# EAGLE schematic FlightControllerBoard (EAGLE 9.0.0)
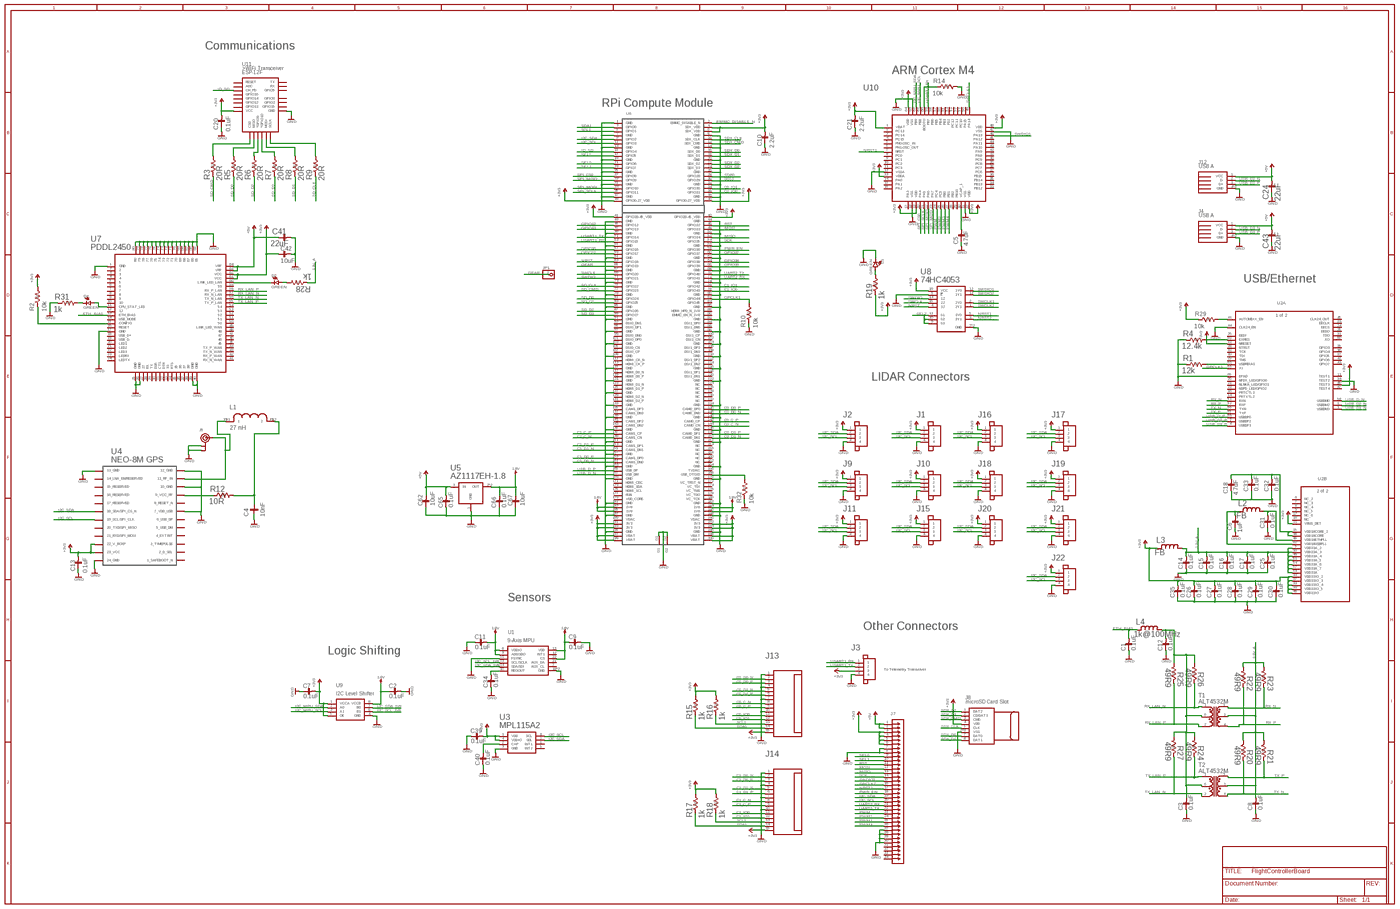
[diagram p0: schematic, sheet 1, overview]
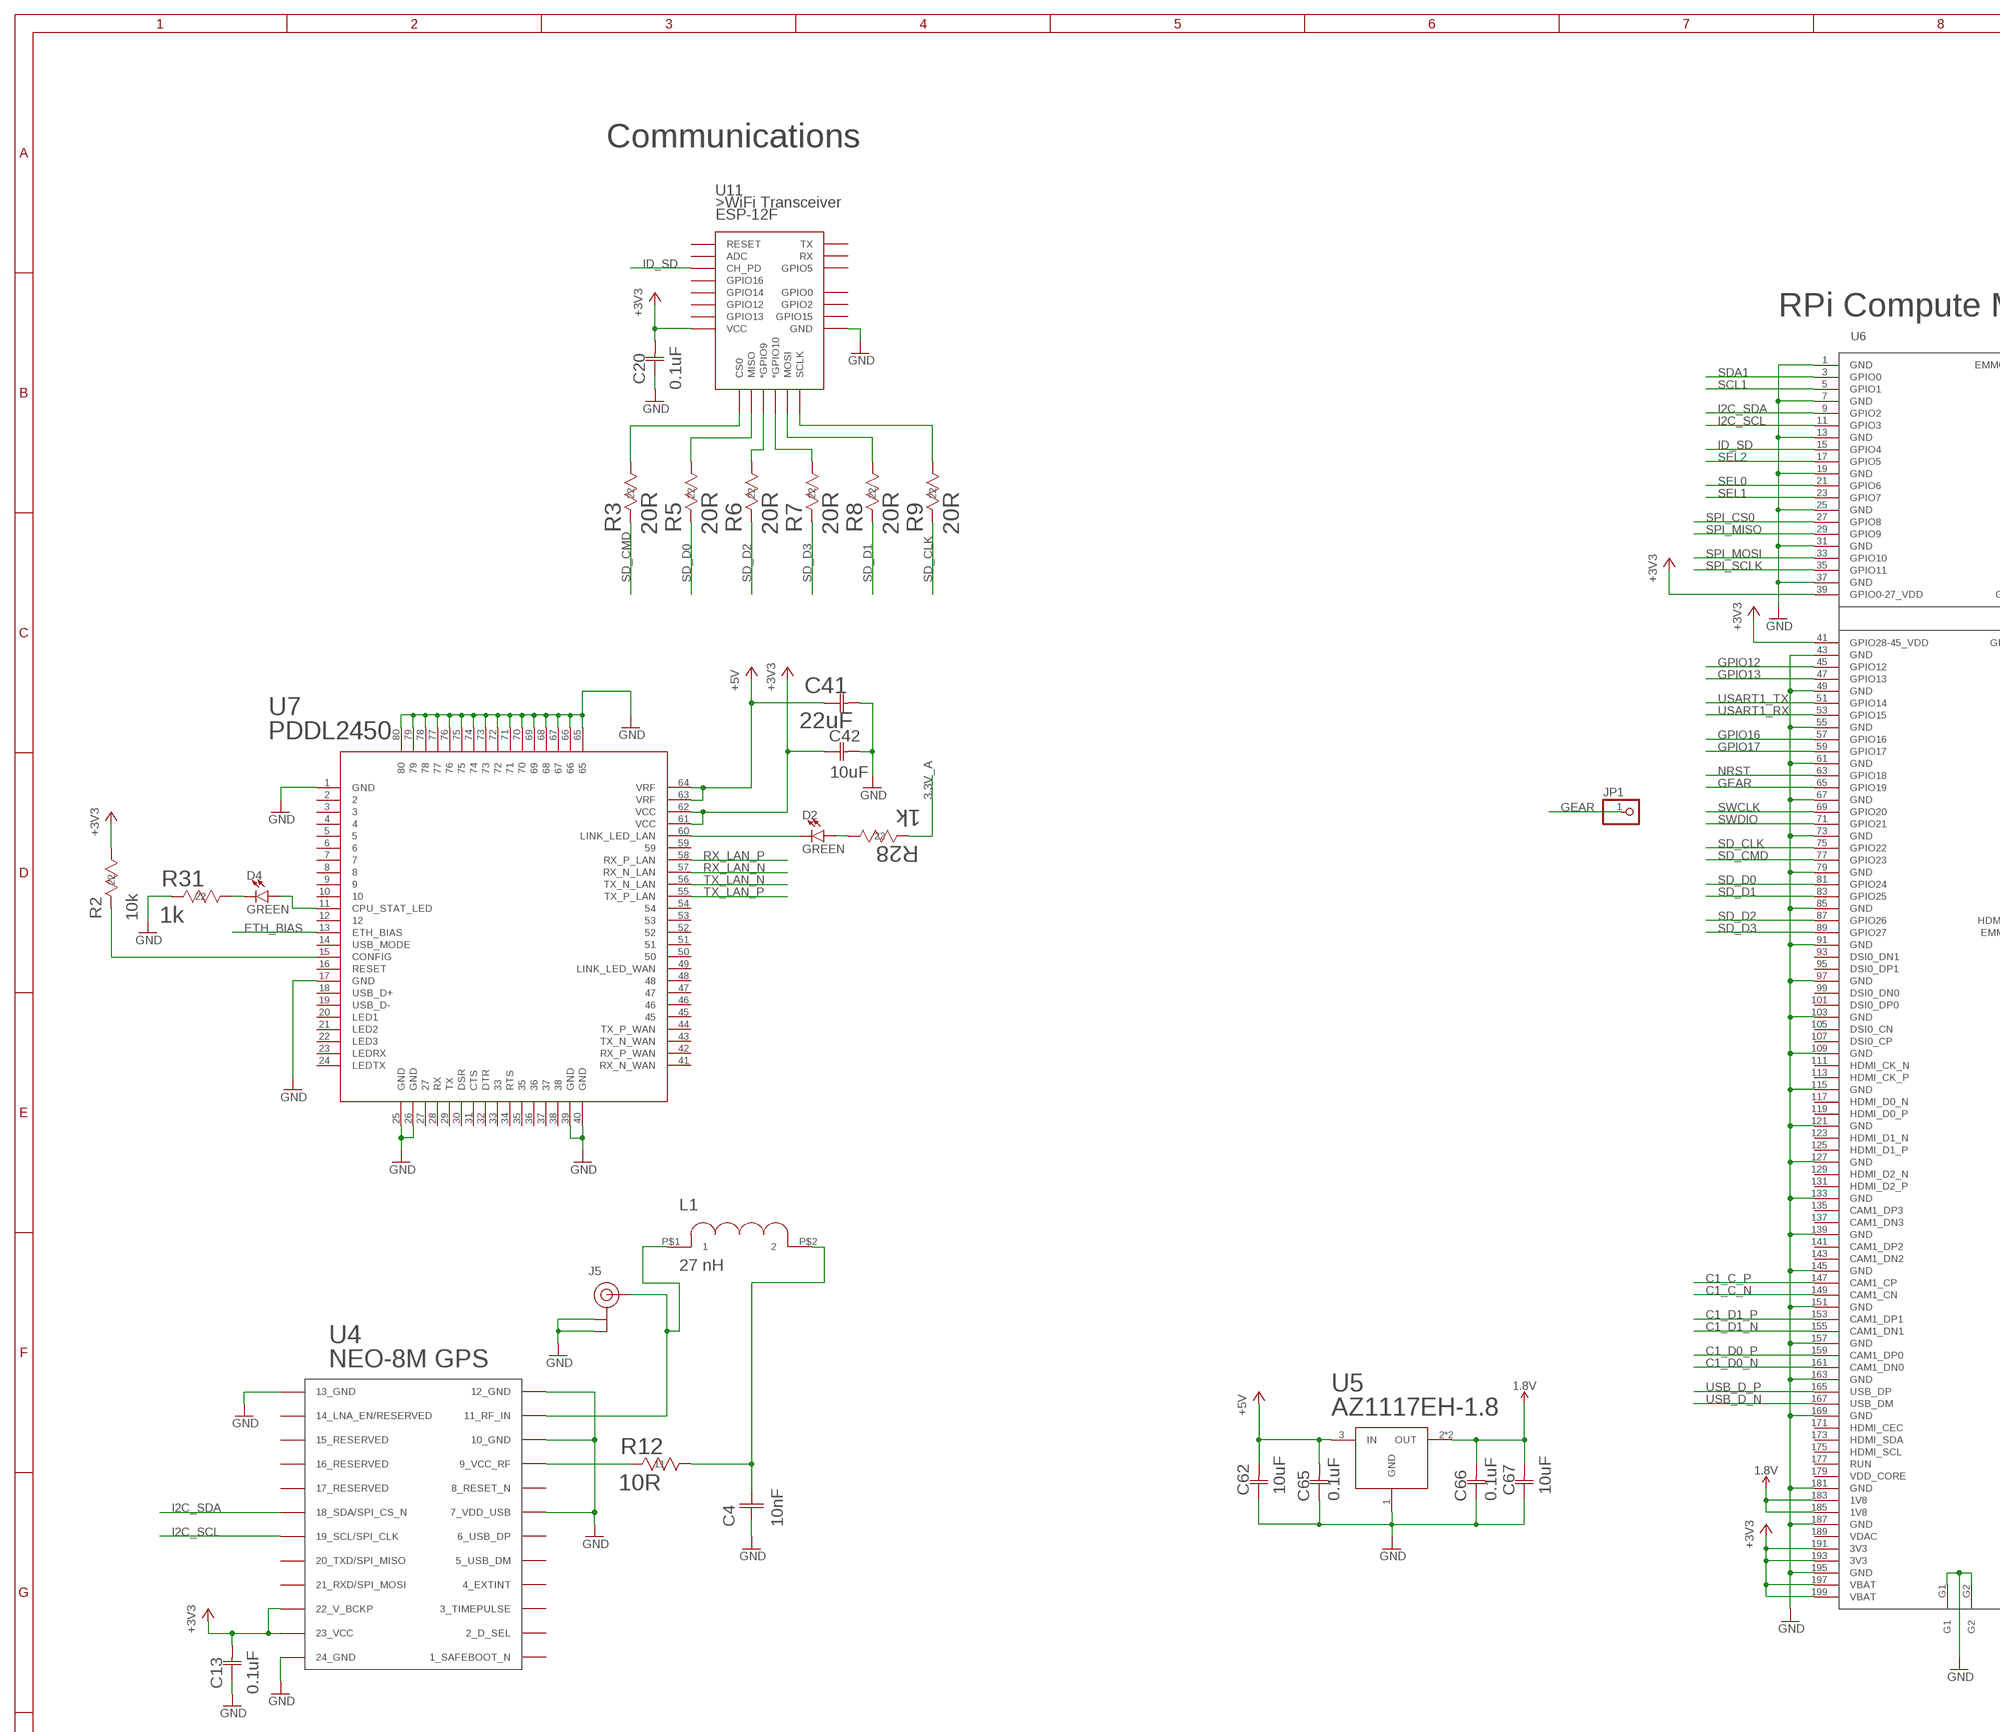
[diagram p1: schematic, sheet 1, part 1 of 4]
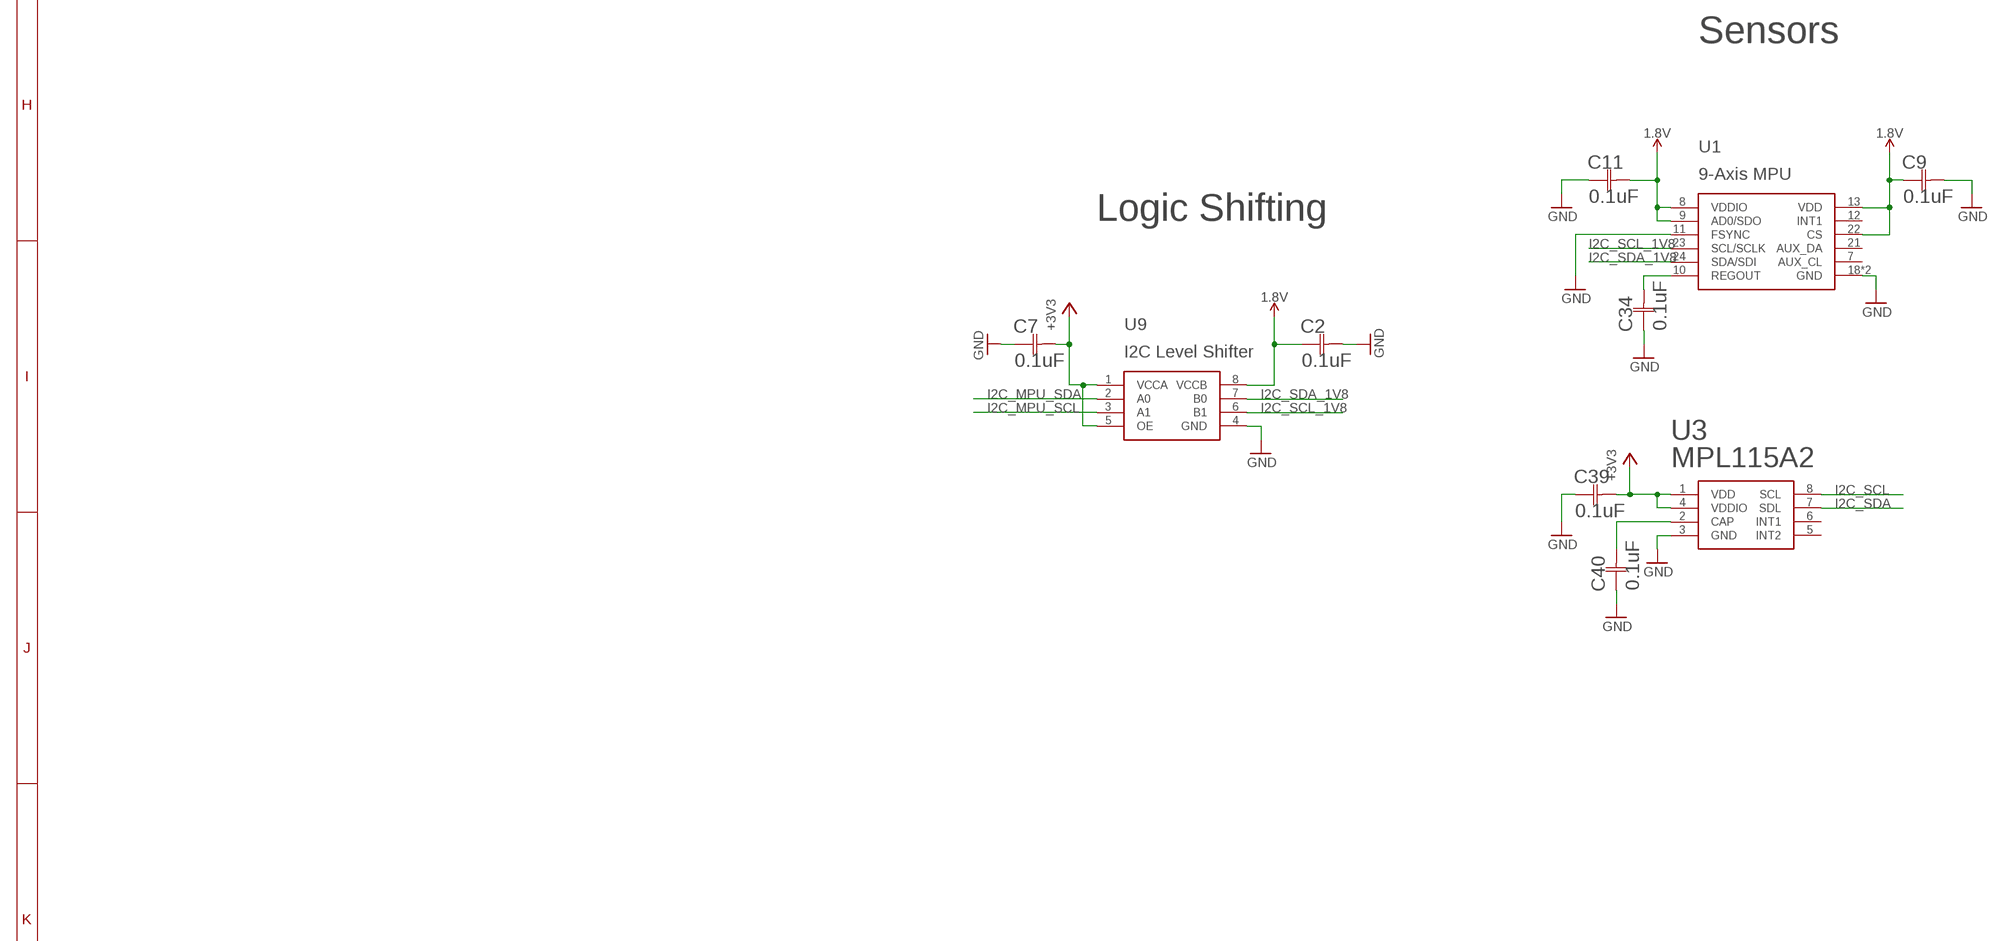
[diagram p2: schematic, sheet 1, part 2 of 4]
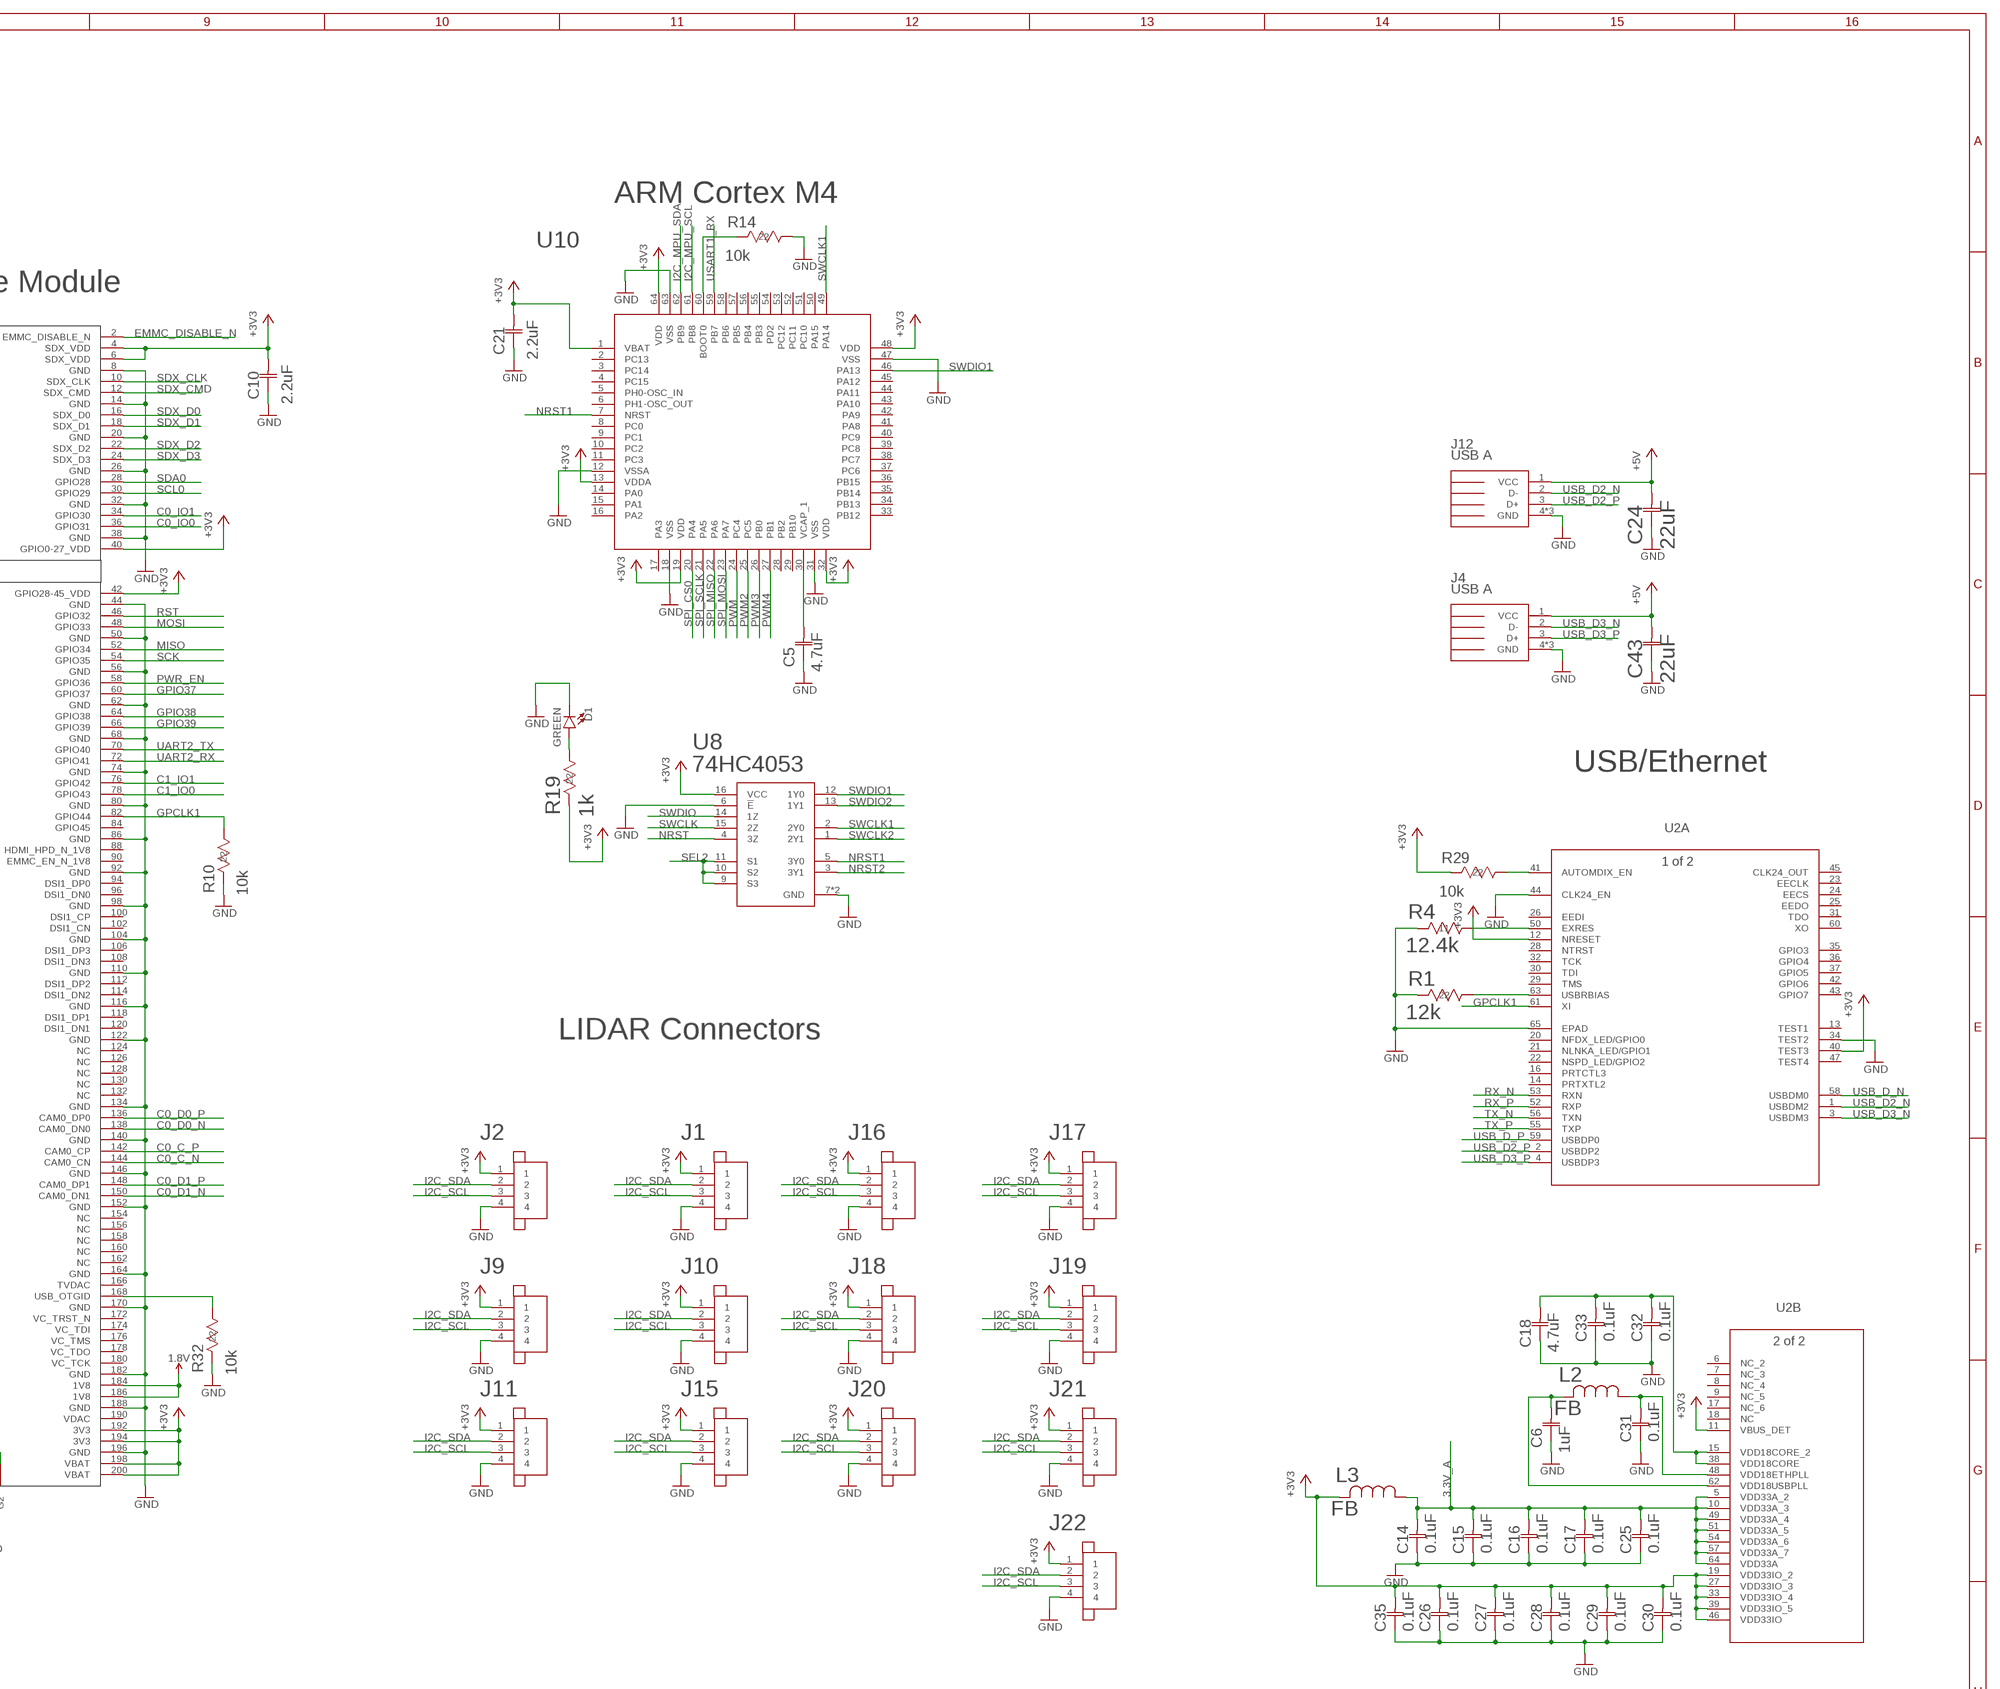
[diagram p3: schematic, sheet 1, part 3 of 4]
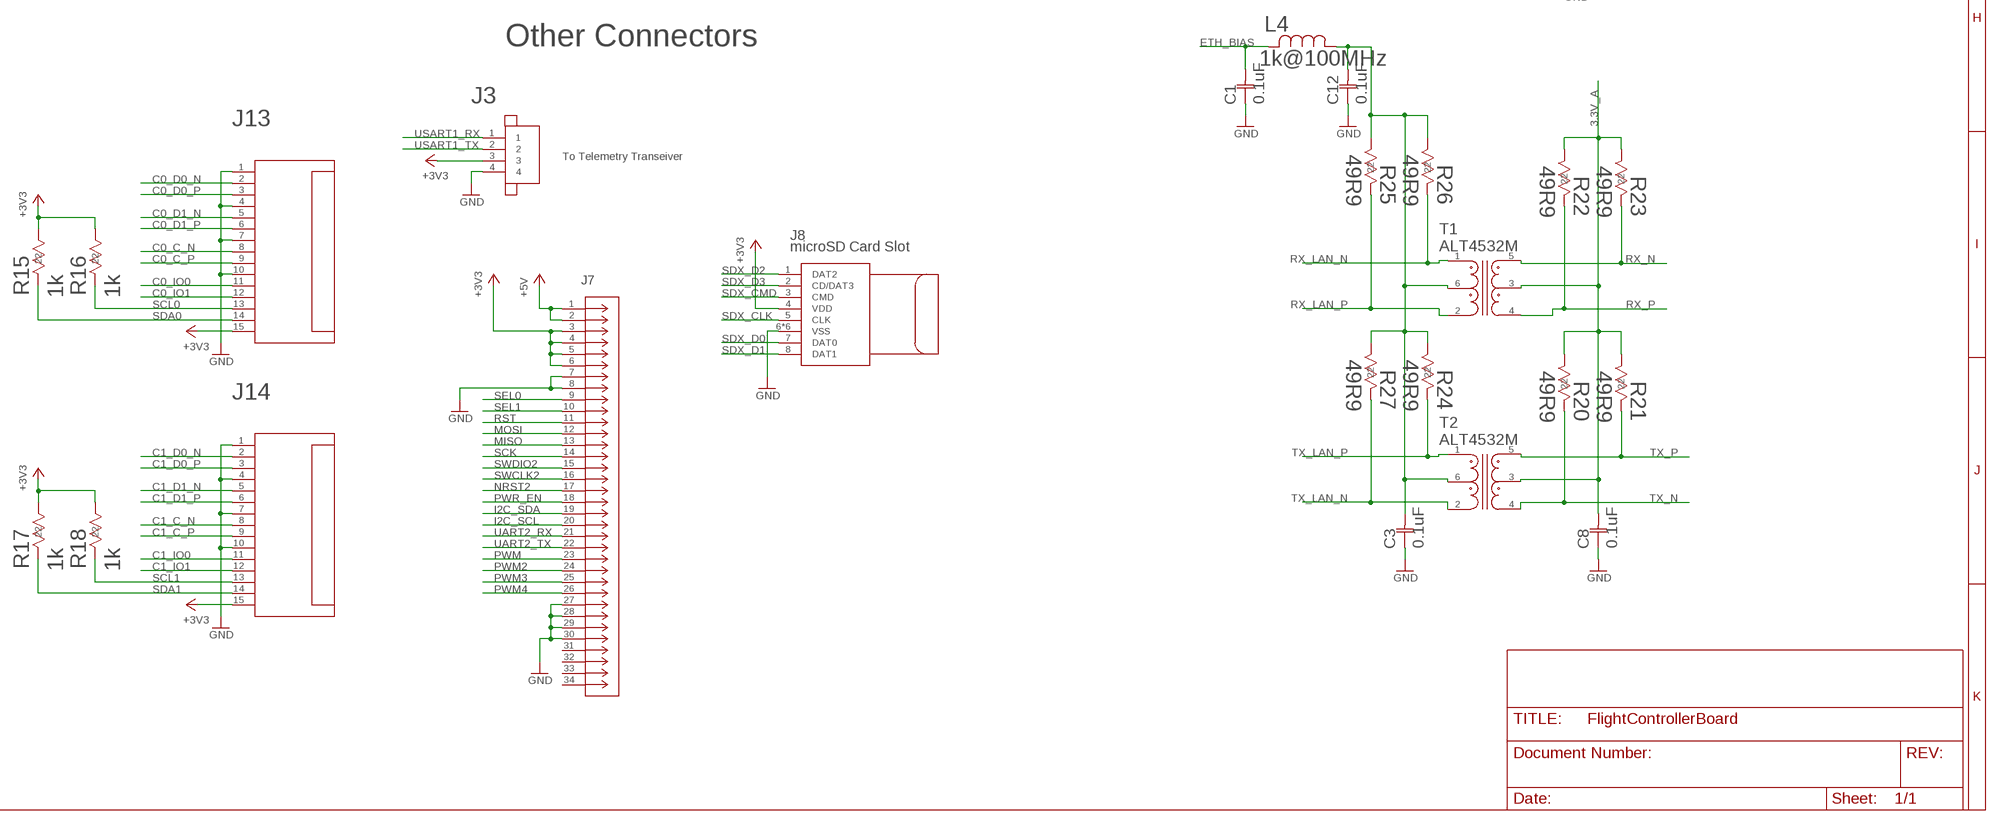
[diagram p4: schematic, sheet 1, part 4 of 4]

## Parts
C1  0.1uF  0402ZD104KAT2A0402-M  [0402-M]
C2  0.1uF  0402ZD104KAT2A0402-M  [0402-M]
C3  0.1uF  0402ZD104KAT2A0402-M  [0402-M]
C4  10nF  10NF_CAPACITOR  [0603_CAPACITOR]
C5  4.7uF  06036D475KAT2A0603-M  [0603-M]
C6  1uF  CC0805KKX7R7BB105  [YAG_CC0805]
C7  0.1uF  0402ZD104KAT2A0402-M  [0402-M]
C8  0.1uF  0402ZD104KAT2A0402-M  [0402-M]
C9  0.1uF  0402ZD104KAT2A0402-M  [0402-M]
C10  2.2uF  GRM188R61C225KE15JG-188-M  [G-188-M]
C11  0.1uF  0402ZD104KAT2A0402-M  [0402-M]
C12  0.1uF  0402ZD104KAT2A0402-M  [0402-M]
C13  0.1uF  08055C104KAT2A  [0805]
C14  0.1uF  0402ZD104KAT2A0402-M  [0402-M]
C15  0.1uF  0402ZD104KAT2A0402-M  [0402-M]
C16  0.1uF  0402ZD104KAT2A0402-M  [0402-M]
C17  0.1uF  0402ZD104KAT2A0402-M  [0402-M]
C18  4.7uF  06036D475KAT2A0603-M  [0603-M]
C20  0.1uF  08055C104KAT2A  [0805]
C21  2.2uF  GRM188R61C225KE15JG-188-M  [G-188-M]
C24  22uF  GRM21BR60J226ME39L  [G-21]
C25  0.1uF  0402ZD104KAT2A0402-M  [0402-M]
C26  0.1uF  0402ZD104KAT2A0402-M  [0402-M]
C27  0.1uF  0402ZD104KAT2A0402-M  [0402-M]
C28  0.1uF  0402ZD104KAT2A0402-M  [0402-M]
C29  0.1uF  0402ZD104KAT2A0402-M  [0402-M]
C30  0.1uF  0402ZD104KAT2A0402-M  [0402-M]
C31  0.1uF  0402ZD104KAT2A0402-M  [0402-M]
C32  0.1uF  0402ZD104KAT2A0402-M  [0402-M]
C33  0.1uF  0402ZD104KAT2A0402-M  [0402-M]
C34  0.1uF  0402ZD104KAT2A0402-M  [0402-M]
C35  0.1uF  0402ZD104KAT2A0402-M  [0402-M]
C39  0.1uF  0402ZD104KAT2A0402-M  [0402-M]
C40  0.1uF  0402ZD104KAT2A0402-M  [0402-M]
C41  22uF  GRM21BR60J226ME39L  [G-21]
C42  10uF  GRM21BR60J106ME19L  [G-21]
C43  22uF  GRM21BR60J226ME39L  [G-21]
C62  10uF  GRM21BR60J106ME19L  [G-21]
C65  0.1uF  0402ZD104KAT2A0402-M  [0402-M]
C66  0.1uF  0402ZD104KAT2A0402-M  [0402-M]
C67  10uF  GRM21BR60J106ME19L  [G-21]
D1  GREEN  LED-GREEN0603  [LED-0603]
D2  GREEN  LED-GREEN0603  [LED-0603]
D4  GREEN  LED-GREEN0603  [LED-0603]
J1  JST_SH_4POS  [JST_SH_4POS]
J2  JST_SH_4POS  [JST_SH_4POS]
J3  JST_SH_4POS  [JST_SH_4POS]
J4  UE27AE54100  [USBA_RECEPT_VERT]
J5  U.FL  [U.FL]
J7  62674-301121ALF  [CON30_1X30_DUT_58XF]
J8  MICROSD  [MICROSD]
J9  JST_SH_4POS  [JST_SH_4POS]
J10  JST_SH_4POS  [JST_SH_4POS]
J11  JST_SH_4POS  [JST_SH_4POS]
J12  UE27AE54100  [USBA_RECEPT_VERT]
J13  0526101572_15ZIF_CONNECTOR  [15POS_FFC_CONNECTOR]
J14  0526101572_15ZIF_CONNECTOR  [15POS_FFC_CONNECTOR]
J15  JST_SH_4POS  [JST_SH_4POS]
J16  JST_SH_4POS  [JST_SH_4POS]
J17  JST_SH_4POS  [JST_SH_4POS]
J18  JST_SH_4POS  [JST_SH_4POS]
J19  JST_SH_4POS  [JST_SH_4POS]
J20  JST_SH_4POS  [JST_SH_4POS]
J21  JST_SH_4POS  [JST_SH_4POS]
J22  JST_SH_4POS  [JST_SH_4POS]
JP1  PINHD-1X1  [1X01]
L1  27 nH  27NH_INDUCTOR  [0402_INDUCTOR]
L2  FB  BLM18AG601SN1DIND_BLM18_0603-M  [IND_BLM18_0603-M]
L3  FB  BLM18AG601SN1DIND_BLM18_0603-M  [IND_BLM18_0603-M]
L4  1k@100MHz  BLM18AG601SN1DIND_BLM18_0603-M  [IND_BLM18_0603-M]
R1  12k  RC0402FR-0712KLRC0402N-M  [RC0402N-M]
R2  10k  RC0603JR-0710KLRC0603N-M  [RC0603N-M]
R3  20R  RC0603JR-0720RLRC0603N-M  [RC0603N-M]
R4  12.4k  RC0402FR-0712K4LYAG_R0402-M  [YAG_R0402-M]
R5  20R  RC0603JR-0720RLRC0603N-M  [RC0603N-M]
R6  20R  RC0603JR-0720RLRC0603N-M  [RC0603N-M]
R7  20R  RC0603JR-0720RLRC0603N-M  [RC0603N-M]
R8  20R  RC0603JR-0720RLRC0603N-M  [RC0603N-M]
R9  20R  RC0603JR-0720RLRC0603N-M  [RC0603N-M]
R10  10k  RC0603JR-0710KLRC0603N-M  [RC0603N-M]
R12  10R  RNCP0805FTD10R0STA_RNCP0805-M  [STA_RNCP0805-M]
R14  10k  RC0603JR-0710KLRC0603N-M  [RC0603N-M]
R15  1k  RC0603JR-071KLRC0603N-M  [RC0603N-M]
R16  1k  RC0603JR-071KLRC0603N-M  [RC0603N-M]
R17  1k  RC0603JR-071KLRC0603N-M  [RC0603N-M]
R18  1k  RC0603JR-071KLRC0603N-M  [RC0603N-M]
R19  1k  RC0603JR-071KLRC0603N-M  [RC0603N-M]
R20  49R9  RC0402FR-0749K9LRC0402N-M  [RC0402N-M]
R21  49R9  RC0402FR-0749K9LRC0402N-M  [RC0402N-M]
R22  49R9  RC0402FR-0749K9LRC0402N-M  [RC0402N-M]
R23  49R9  RC0402FR-0749K9LRC0402N-M  [RC0402N-M]
R24  49R9  RC0402FR-0749K9LRC0402N-M  [RC0402N-M]
R25  49R9  RC0402FR-0749K9LRC0402N-M  [RC0402N-M]
R26  49R9  RC0402FR-0749K9LRC0402N-M  [RC0402N-M]
R27  49R9  RC0402FR-0749K9LRC0402N-M  [RC0402N-M]
R28  1k  RC0603JR-071KLRC0603N-M  [RC0603N-M]
R29  10k  RC0603JR-0710KLRC0603N-M  [RC0603N-M]
R31  1k  RC0603JR-071KLRC0603N-M  [RC0603N-M]
R32  10k  RC0603JR-0710KLRC0603N-M  [RC0603N-M]
T1  ALT4532M  [ALT4532]
T2  ALT4532M  [ALT4532]
U1  ICM-20948  [QFN40P300X300X105-25N]
U2  LAN9512-JZXQFN64_9X9MC-M  [QFN64_9X9MC-M]
U3  MPL115A2  [LGA8-M]
U4  NEO-M8  [NEO-M8]
U5  AZ1117EH-1.8  [SOT-223]
U6  COMPUTE_MODULE  [SO-DIMM]
U7  PDDL2450  [PDDL2450_SOCKET]
U8  74HC4053  [TSSOP16]
U9  FXMAR2102  [8-UMLP]
U10  STM32F446  [LQFP64]
U11  ESP12ESMD  [ESP12E-SMD]

## Nets
1.8V: C2.1 C9.1 C11.2 C66.2 C67.2 U1.8(VDDIO) U1.9(AD0/SDO) U1.13(VDD) U1.22(CS) U5.2(OUT) U5.4(OUT) U6.183(1V8) U6.184(1V8) U6.185(1V8) U6.186(1V8) U9.8(VCCB)
3.3V_A: C8.2 C14.2 C15.2 C16.2 C17.2 C25.2 L3.1 R20.1 R21.1 R22.1 R23.1 R28.2 T1.3 T2.3 U2.5(B:VDD33A_2) U2.10(B:VDD33A_3) U2.49(B:VDD33A_4) U2.51(B:VDD33A_5) U2.54(B:VDD33A_6) U2.57(B:VDD33A_7) U2.64(B:VDD33A)
+3V3: C7.2 C10.2 C13.2 C20.2 C21.2 C26.2 C27.2 C28.2 C29.2 C30.2 C35.2 C39.2 C42.1 J1.1 J2.1 J3.3 J7.3 J7.4 J7.5 J7.6 J8.4(VDD) J9.1 J10.1 J11.1 J13.15 J14.15 J15.1 J16.1 J17.1 J18.1 J19.1 J20.1 J21.1 J22.1 L3.2 R2.1 R15.1 R16.1 R17.1 R18.1 R19.2 R29.2 U2.11(B:VBUS_DET) U2.12(A:NRESET) U2.19(B:VDD33IO_2) U2.27(B:VDD33IO_3) U2.33(B:VDD33IO_4) U2.39(B:VDD33IO_5) U2.40(A:TEST3) U2.46(B:VDD33IO) U3.1(VDD) U3.4(VDDIO) U4.22(22_V_BCKP) U4.23(23_VCC) U6.4(SDX_VDD) U6.6(SDX_VDD) U6.39(GPIO0-27_VDD) U6.40(GPIO0-27_VDD) U6.41(GPIO28-45_VDD) U6.42(GPIO28-45_VDD) U6.191(3V3) U6.192(3V3) U6.193(3V3) U6.194(3V3) U6.197(VBAT) U6.198(VBAT) U6.199(VBAT) U6.200(VBAT) U7.61(VCC) U7.62(VCC) U8.16(VCC) U9.1(VCCA) U9.5(OE) U10.1(VBAT) U10.13(VDDA) U10.19(VDD) U10.32(VDD) U10.48(VDD) U10.64(VDD) U11.VCC
+5V: C24.2 C41.1 C43.2 C62.2 C65.2 J4.1(VCC) J7.1 J7.2 J12.1(VCC) U5.3(IN) U7.63(VRF) U7.64(VRF)
C0_C_N: J13.8 U6.144(CAM0_CN)
C0_C_P: J13.9 U6.142(CAM0_CP)
C0_D0_N: J13.2 U6.138(CAM0_DN0)
C0_D0_P: J13.3 U6.136(CAM0_DP0)
C0_D1_N: J13.5 U6.150(CAM0_DN1)
C0_D1_P: J13.6 U6.148(CAM0_DP1)
C0_IO0: J13.11 U6.36(GPIO31)
C0_IO1: J13.12 U6.34(GPIO30)
C1_C_N: J14.8 U6.149(CAM1_CN)
C1_C_P: J14.9 U6.147(CAM1_CP)
C1_D0_N: J14.2 U6.161(CAM1_DN0)
C1_D0_P: J14.3 U6.159(CAM1_DP0)
C1_D1_N: J14.5 U6.155(CAM1_DN1)
C1_D1_P: J14.6 U6.153(CAM1_DP1)
C1_IO0: J14.11 U6.78(GPIO43)
C1_IO1: J14.12 U6.76(GPIO42)
EMMC_DISABLE_N: U6.2(EMMC_DISABLE_N)
ETH_BIAS: C1.2 L4.2 U7.13(ETH_BIAS)
GEAR: JP1.1 U6.65(GPIO19)
GND: C1.1 C2.2 C3.1 C4.1 C5.1 C6.1 C7.1 C8.1 C9.2 C10.1 C11.1 C12.1 C13.1 C14.1 C15.1 C16.1 C17.1 C18.1 C20.1 C21.1 C24.1 C25.1 C26.1 C27.1 C28.1 C29.1 C30.1 C31.1 C32.1 C33.1 C34.1 C35.1 C39.1 C40.1 C41.2 C42.2 C43.1 C62.1 C65.1 C66.1 C67.1 D1.C J1.4 J2.4 J3.4 J4.4(GND) J4.P$5(GND) J4.P$6(GND) J5.P$1(GND) J5.P$2(GND) J7.7 J7.8 J7.27 J7.28 J7.29 J7.30 J8.6(VSS) J8.9(VSS) J8.10(VSS) J8.11(VSS) J8.12(VSS) J8.13(VSS) J9.4 J10.4 J11.4 J12.4(GND) J12.P$5(GND) J12.P$6(GND) J13.1 J13.4 J13.7 J13.10 J14.1 J14.4 J14.7 J14.10 J15.4 J16.4 J17.4 J18.4 J19.4 J20.4 J21.4 J22.4 R1.2 R4.1 R10.2 R14.1 R31.2 R32.2 U1.11(FSYNC) U1.18(GND) U1.20(GND) U2.34(A:TEST2) U2.44(A:CLK24_EN) U2.65(A:EPAD) U3.3(GND) U4.7(7_VDD_USB) U4.10(10_GND) U4.12(12_GND) U4.13(13_GND) U4.24(24_GND) U5.1(GND) U6.1(GND) U6.7(GND) U6.8(GND) U6.13(GND) U6.14(GND) U6.19(GND) U6.20(GND) U6.25(GND) U6.26(GND) U6.31(GND) U6.32(GND) U6.37(GND) U6.38(GND) U6.43(GND) U6.44(GND) U6.49(GND) U6.50(GND) U6.55(GND) U6.56(GND) U6.61(GND) U6.62(GND) U6.67(GND) U6.68(GND) U6.73(GND) U6.74(GND) U6.79(GND) U6.80(GND) U6.85(GND) U6.86(GND) U6.91(GND) U6.92(GND) U6.97(GND) U6.98(GND) U6.103(GND) U6.104(GND) U6.109(GND) U6.110(GND) U6.115(GND) U6.116(GND) U6.121(GND) U6.122(GND) U6.127(GND) U6.133(GND) U6.134(GND) U6.139(GND) U6.140(GND) U6.145(GND) U6.146(GND) U6.151(GND) U6.152(GND) U6.157(GND) U6.163(GND) U6.164(GND) U6.169(GND) U6.170(GND) U6.181(GND) U6.182(GND) U6.187(GND) U6.188(GND) U6.195(GND) U6.196(GND) U6.G1 U6.G2 U7.1(GND) U7.17(GND) U7.25(GND) U7.26(GND) U7.39(GND) U7.40(GND) U7.65 U7.66 U7.67 U7.68 U7.69 U7.70 U7.71 U7.72 U7.73 U7.74 U7.75 U7.76 U7.77 U7.78 U7.79 U7.80 U8.6(!E) U8.7(GND) U8.8(GND) U9.4(GND) U10.12(VSSA) U10.18(VSS) U10.31(VSS) U10.47(VSS) U10.63(VSS) U11.GND
GND1: D2.C U7.60(LINK_LED_LAN)
GPCLK1: R10.1 U2.61(A:XI) U6.82(GPIO44)
GPIO12: U6.45(GPIO12)
GPIO13: U6.47(GPIO13)
GPIO16: U6.57(GPIO16)
GPIO17: U6.59(GPIO17)
GPIO37: U6.60(GPIO37)
GPIO38: U6.64(GPIO38)
GPIO39: U6.66(GPIO39)
I2C_MPU_SCL: U9.3(A1) U10.61(PB8)
I2C_MPU_SDA: U9.2(A0) U10.62(PB9)
I2C_SCL: J1.3 J2.3 J7.20 J9.3 J10.3 J11.3 J15.3 J16.3 J17.3 J18.3 J19.3 J20.3 J21.3 J22.3 U3.8(SCL) U4.19(19_SCL/SPI_CLK) U6.11(GPIO3)
I2C_SCL_1V8: U1.23(SCL/SCLK) U9.6(B1)
I2C_SDA: J1.2 J2.2 J7.19 J9.2 J10.2 J11.2 J15.2 J16.2 J17.2 J18.2 J19.2 J20.2 J21.2 J22.2 U3.7(SDL) U4.18(18_SDA/SPI_CS_N) U6.9(GPIO2)
I2C_SDA_1V8: U1.24(SDA/SDI) U9.7(B0)
ID_SD: U6.15(GPIO4) U11.CH_PD
MISO: J7.13 U6.52(GPIO34)
MOSI: J7.12 U6.48(GPIO33)
N$1: J5.P$3(SIGNAL) L1.P$1 U4.11(11_RF_IN)
N$2: C34.2 U1.10(REGOUT)
N$3: R29.1 U2.41(A:AUTOMDIX_EN)
N$4: D1.A R19.1
N$5: R1.1 U2.63(A:USBRBIAS)
N$6: C40.2 U3.2(CAP)
N$7: R3.1 U11.CS0
N$8: R5.1 U11.MISO
N$9: R6.1 U11.GPIO9(*GPIO9)
N$10: R7.1 U11.GPIO10(*GPIO10)
N$11: C5.2 U10.30(VCAP_1)
N$12: D2.A R28.1
N$13: R12.1 U4.9(9_VCC_RF)
N$14: R8.1 U11.MOSI
N$15: R9.1 U11.SCLK
N$16: R14.2 U10.60(BOOT0)
N$18: C31.2 L2.1 U2.48(B:VDD18ETHPLL)
N$19: C6.2 L2.2 U2.62(B:VDD18USBPLL)
N$20: R4.2 U2.50(A:EXRES)
N$21: C18.2 C32.2 C33.2 U2.15(B:VDD18CORE_2) U2.38(B:VDD18CORE)
N$23: C3.2 C12.2 L4.1 R24.1 R25.1 R26.1 R27.1 T1.6 T2.6
N$24: R2.2 U7.15(CONFIG)
N$25: D4.A U7.11(CPU_STAT_LED)
N$26: C4.2 L1.P$2 R12.2
N$27: D4.C R31.1
N$53: R32.1 U6.168(USB_OTGID)
NRST: U6.63(GPIO18) U8.4(3Z)
NRST1: U8.5(3Y0) U10.7(NRST)
NRST2: J7.17 U8.3(3Y1)
PWM: J7.23 U10.24(PC4)
PWM2: J7.24 U10.25(PC5)
PWM3: J7.25 U10.26(PB0)
PWM4: J7.26 U10.27(PB1)
PWR_EN: J7.18 U6.58(GPIO36)
RST: J7.11 U6.46(GPIO32)
RX_LAN_N: R26.2 T1.1 U7.57(RX_N_LAN)
RX_LAN_P: R25.2 T1.2 U7.58(RX_P_LAN)
RX_N: R23.2 T1.5 U2.53(A:RXN)
RX_P: R22.2 T1.4 U2.52(A:RXP)
SCK: J7.14 U6.54(GPIO35)
SCL0: J13.13 R16.2 U6.30(GPIO29)
SCL1: J14.13 R18.2 U6.5(GPIO1)
SD_CLK: R9.2 U6.75(GPIO22)
SD_CMD: R3.2 U6.77(GPIO23)
SD_D0: R5.2 U6.81(GPIO24)
SD_D1: R8.2 U6.83(GPIO25)
SD_D2: R6.2 U6.87(GPIO26)
SD_D3: R7.2 U6.89(GPIO27)
SDA0: J13.14 R15.2 U6.28(GPIO28)
SDA1: J14.14 R17.2 U6.3(GPIO0)
SDX_CLK: J8.5(CLK) U6.10(SDX_CLK)
SDX_CMD: J8.3(CMD) U6.12(SDX_CMD)
SDX_D0: J8.7(DAT0) U6.16(SDX_D0)
SDX_D1: J8.8(DAT1) U6.18(SDX_D1)
SDX_D2: J8.1(DAT2) U6.22(SDX_D2)
SDX_D3: J8.2(CD/DAT3) U6.24(SDX_D3)
SEL0: J7.9 U6.21(GPIO6)
SEL1: J7.10 U6.23(GPIO7)
SEL2: U6.17(GPIO5) U8.9(S3) U8.10(S2) U8.11(S1)
SPI_CS0: U6.27(GPIO8) U10.20(PA4)
SPI_MISO: U6.29(GPIO9) U10.22(PA6)
SPI_MOSI: U6.33(GPIO10) U10.23(PA7)
SPI_SCLK: U6.35(GPIO11) U10.21(PA5)
SWCLK: U6.69(GPIO20) U8.15(2Z)
SWCLK1: U8.2(2Y0) U10.49(PA14)
SWCLK2: J7.16 U8.1(2Y1)
SWDIO: U6.71(GPIO21) U8.14(1Z)
SWDIO1: U8.12(1Y0) U10.46(PA13)
SWDIO2: J7.15 U8.13(1Y1)
TX_LAN_N: R27.2 T2.2 U7.56(TX_N_LAN)
TX_LAN_P: R24.2 T2.1 U7.55(TX_P_LAN)
TX_N: R20.2 T2.4 U2.56(A:TXN)
TX_P: R21.2 T2.5 U2.55(A:TXP)
UART2_RX: J7.21 U6.72(GPIO41)
UART2_TX: J7.22 U6.70(GPIO40)
USART1_RX: J3.1 U6.53(GPIO15) U10.59(PB7)
USART1_TX: J3.2 U6.51(GPIO14)
USB_D2_N: J12.2(D-) U2.1(A:USBDM2)
USB_D2_P: J12.3(D+) U2.2(A:USBDP2)
USB_D3_N: J4.2(D-) U2.3(A:USBDM3)
USB_D3_P: J4.3(D+) U2.4(A:USBDP3)
USB_D_N: U2.58(A:USBDM0) U6.167(USB_DM)
USB_D_P: U2.59(A:USBDP0) U6.165(USB_DP)
Unconnected: J7.31 J7.32 J7.33 J7.34 U1.7(AUX_CL) U1.12(INT1) U1.21(AUX_DA) U2.6(B:NC_2) U2.7(B:NC_3) U2.8(B:NC_4) U2.9(B:NC_5) U2.13(A:TEST1) U2.14(A:PRTXTL2) U2.16(A:PRTCTL3) U2.17(B:NC_6) U2.18(B:NC) U2.20(A:NFDX_LED/GPIO0) U2.21(A:NLNKA_LED/GPIO1) U2.22(A:NSPD_LED/GPIO2) U2.23(A:EECLK) U2.24(A:EECS) U2.25(A:EEDO) U2.26(A:EEDI) U2.28(A:NTRST) U2.29(A:TMS) U2.30(A:TDI) U2.31(A:TDO) U2.32(A:TCK) U2.35(A:GPIO3) U2.36(A:GPIO4) U2.37(A:GPIO5) U2.42(A:GPIO6) U2.43(A:GPIO7) U2.45(A:CLK24_OUT) U2.47(A:TEST4) U2.60(A:XO) U3.5(INT2) U3.6(INT1) U4.1(1_SAFEBOOT_N) U4.2(2_D_SEL) U4.3(3_TIMEPULSE) U4.4(4_EXTINT) U4.5(5_USB_DM) U4.6(6_USB_DP) U4.8(8_RESET_N) U4.14(14_LNA_EN/RESERVED) U4.15(15_RESERVED) U4.16(16_RESERVED) U4.17(17_RESERVED) U4.20(20_TXD/SPI_MISO) U4.21(21_RXD/SPI_MOSI) U6.84(GPIO45) U6.88(HDMI_HPD_N_1V8) U6.90(EMMC_EN_N_1V8) U6.93(DSI0_DN1) U6.94(DSI1_DP0) U6.95(DSI0_DP1) U6.96(DSI1_DN0) U6.99(DSI0_DN0) U6.100(DSI1_CP) U6.101(DSI0_DP0) U6.102(DSI1_CN) U6.105(DSI0_CN) U6.106(DSI1_DP3) U6.107(DSI0_CP) U6.108(DSI1_DN3) U6.111(HDMI_CK_N) U6.112(DSI1_DP2) U6.113(HDMI_CK_P) U6.114(DSI1_DN2) U6.117(HDMI_D0_N) U6.118(DSI1_DP1) U6.119(HDMI_D0_P) U6.120(DSI1_DN1) U6.123(HDMI_D1_N) U6.124(NC) U6.125(HDMI_D1_P) U6.126(NC) U6.128(NC) U6.129(HDMI_D2_N) U6.130(NC) U6.131(HDMI_D2_P) U6.132(NC) U6.135(CAM1_DP3) U6.137(CAM1_DN3) U6.141(CAM1_DP2) U6.143(CAM1_DN2) U6.154(NC) U6.156(NC) U6.158(NC) U6.160(NC) U6.162(NC) U6.166(TVDAC) U6.171(HDMI_CEC) U6.172(VC_TRST_N) U6.173(HDMI_SDA) U6.174(VC_TDI) U6.175(HDMI_SCL) U6.176(VC_TMS) U6.177(RUN) U6.178(VC_TDO) U6.179(VDD_CORE) U6.180(VC_TCK) U6.189(VDAC) U6.190(VDAC) U7.2 U7.3 U7.4 U7.5 U7.6 U7.7 U7.8 U7.9 U7.10 U7.12 U7.14(USB_MODE) U7.16(RESET) U7.18(USB_D+) U7.19(USB_D-) U7.20(LED1) U7.21(LED2) U7.22(LED3) U7.23(LEDRX) U7.24(LEDTX) U7.27 U7.28(RX) U7.29(TX) U7.30(DSR) U7.31(CTS) U7.32(DTR) U7.33 U7.34(RTS) U7.35 U7.36 U7.37 U7.38 U7.41(RX_N_WAN) U7.42(RX_P_WAN) U7.43(TX_N_WAN) U7.44(TX_P_WAN) U7.45 U7.46 U7.47 U7.48 U7.49(LINK_LED_WAN) U7.50 U7.51 U7.52 U7.53 U7.54 U7.59 U10.2(PC13) U10.3(PC14) U10.4(PC15) U10.5(PH0-OSC_IN) U10.6(PH1-OSC_OUT) U10.8(PC0) U10.9(PC1) U10.10(PC2) U10.11(PC3) U10.14(PA0) U10.15(PA1) U10.16(PA2) U10.17(PA3) U10.28(PB2) U10.29(PB10) U10.33(PB12) U10.34(PB13) U10.35(PB14) U10.36(PB15) U10.37(PC6) U10.38(PC7) U10.39(PC8) U10.40(PC9) U10.41(PA8) U10.42(PA9) U10.43(PA10) U10.44(PA11) U10.45(PA12) U10.50(PA15) U10.51(PC10) U10.52(PC11) U10.53(PC12) U10.54(PD2) U10.55(PB3) U10.56(PB4) U10.57(PB5) U10.58(PB6) U11.ADC U11.GPIO0 U11.GPIO2 U11.GPIO5 U11.GPIO12 U11.GPIO13 U11.GPIO14 U11.GPIO15 U11.GPIO16 U11.RESET U11.RXD0(RX) U11.TXD0(TX)

## Notes on the sheet
- Communications
- ARM Cortex M4
- RPi Compute Module
- USB/Ethernet
- LIDAR Connectors
- Sensors
- Other Connectors
- Logic Shifting
- To Telemetry Transeiver

## Library data of the parts
C1-C3 C7-C9 C11 C12 C14-C17 C25-C35 C39 C40 C65 C66 = 0.1uF-capacitor-0402:0402ZD104KAT2A; MANUFACTURER_PART_NUMBER: 0402ZD104KAT2A; VENDOR: AVX Corporation
C4 = thanics_robotics:10NF_CAPACITOR
C5 C18 = 4.7uF-capacitor:06036D475KAT2A; MANUFACTURER_PART_NUMBER: 06036D475KAT2A; VENDOR: AVX Corporation
C6 = 1uF X7R Ceramic Capacitor:CC0805KKX7R7BB105; COPYRIGHT: Copyright C 2015 Accelerated Designs. All rights reserved; MANUFACTURER_PART_NUMBER: CC0805KKX7R7BB105; VENDOR: Vendor
C10 C21 = 2.2uF X5R Capacitor:GRM188R61C225KE15J; COPYRIGHT: Copyright C 2015 Accelerated Designs. All rights reserved; MANUFACTURER_PART_NUMBER: GRM188R61C225KE15J; VENDOR: Vendor
C13 C20 = 0.1uF X7R Ceramic Capacitor:08055C104KAT2A; COPYRIGHT: Copyright C 2015 Accelerated Designs. All rights reserved; MANUFACTURER_PART_NUMBER: 08055C104KAT2A; VENDOR: Vendor
C24 C41 C43 = 22uF X5R Ceramic Capacitor:GRM21BR60J226ME39L; COPYRIGHT: Copyright C 2015 Accelerated Designs. All rights reserved; MANUFACTURER_PART_NUMBER: GRM21BR60J226ME39L; VENDOR: Vendor
C42 C62 C67 = 10uF X5R Ceramic Capacitor:GRM21BR60J106ME19L; COPYRIGHT: Copyright C 2015 Accelerated Designs. All rights reserved; MANUFACTURER_PART_NUMBER: GRM21BR60J106ME19L; VENDOR: Vendor
D1 D2 D4 = SparkFun-LED:LED-GREEN: Green SMD LED Used in manufacturing of various products at SparkFun Packages: 0603 - SMD 0603 package [Product Link] <http://www.futureelectronics.com/en/technologies/semiconductors/optoelectronics/leds/Pages/9894312-LTST-C190GKT.aspx?CrossPart=HSMG-C190&IM=0> LilyPad 1206 - SMD1206 LilyPad package [Product Link] <http://www.futureelectronics.com/en/Technologies/Product.aspx?ProductID=IN150NGHARVATEKCORPORATION2049943&IM=0> 1206 - SMD1206 package [Product Link] <http://www.futureelectronics.com/en/technologies/semiconductors/optoelectronics/leds/Pages/8315665-LTST-C150KGKT.aspx?IM=0> 1206 Bottom Mount -SMD 1206 Bottom Mount [Product Link] <http://www.digikey.com/product-detail/en/lite-on-inc/LTST-C230KGKT/160-1456-1-ND/386854> SparkFun Products: Pro Mini 328 -5V <https://www.sparkfun.com/products/821> RedBoard <https://www.sparkfun.com/products/12757> MP3 Trigger <https://www.sparkfun.com/products/13720> Makey Makey <https://www.sparkfun.com/products/11076>; PROD_ID: DIO-00821
J1-J3 J9-J11 J15-J22 = thanics_robotics:JST_SH_4POS
J4 J12 = thanics_robotics:UE27AE54100
J5 = SparkFun-Connectors:U.FL: SMD Antenna Connector - U.FL 2mm height, 3.0mm x 3.0mm receptacle size. SparkFun Products: SparkFun WiFi Shield - ESP8266 <https://www.sparkfun.com/products/13287> SparkFun ESP8266 Thing <https://www.sparkfun.com/products/13231> SparkFun MiniGen - Pro Mini Signal Generator Shield <https://www.sparkfun.com/products/11420>; PROD_ID: CONN-09193; SF_ID: WRL-09144
J7 = 30pin_ffc_connector:62674-301121ALF; MANUFACTURER_PART_NUMBER: 62674301121ALF; VENDOR: FCI
J8 = thanics_robotics:MICROSD
J13 J14 = thanics_robotics:0526101572_15ZIF_CONNECTOR
JP1 = pinhead:PINHD-1X1: PIN HEADER
L1 = thanics_robotics:27NH_INDUCTOR
L2-L4 = 600ohm-fb:BLM18AG601SN1D; MANUFACTURER_PART_NUMBER: BLM18AG601SN1D; VENDOR: MURATA
R1 = 12k-resistor:RC0402FR-0712KL; MANUFACTURER_PART_NUMBER: RC0402FR0712KL; VENDOR: Yageo
R2 R10 R14 R29 R32 = 10k-resistor(0603):RC0603JR-0710KL; MANUFACTURER_PART_NUMBER: RC0603JR0710KL; VENDOR: Yageo
R3 R5-R9 = 20-resistor:RC0603JR-0720RL; MANUFACTURER_PART_NUMBER: RC0603JR0720RL; VENDOR: Yageo
R4 = 12.4k-resistor:RC0402FR-0712K4L; MANUFACTURER_PART_NUMBER: RC0402FR0712K4L; VENDOR: Yageo
R12 = 10-resistor:RNCP0805FTD10R0; COPYRIGHT: Copyright C 2015 Accelerated Designs. All rights reserved; MANUFACTURER_PART_NUMBER: RNCP0805FTD10R0; VENDOR: Vendor
R15-R19 R28 R31 = 1k-resistor:RC0603JR-071KL; CASE: 0603 1608 metric; COMPOSITION: Thick Film; COPYRIGHT: Copyright C 2015 Accelerated Designs. All rights reserved; DATASHEET: httpwww.yageo.comdocumentsrecentPYuRC0603_51_RoHS_L_4.pdf; DESCRIPTION: RES 1.0K OHM 110W 5% 0603 SMD; DIGIKEYPARTNUMBER: 3111.0KGRTRND; HEIGHT: 0.022" 0.55mm; LEADSTYLE: Surface Mount SMD SMT; MANUFACTURER_PART_NUMBER: RC0603JR071KL; NEWARKPARTNUMBER: 14M7231; NUMBEROFTERMINATIONS: 2; PACKAGECASE: 0603 1608 Metric; PACKAGING: Tape &amp Reel TR; POWERWATTS: 0.1W 110W; QUANTITY_AVAILABLE: 0; RESISTANCEINOHMS: 1.00K; RESISTANCEOHMS: 1K; SIZEDIMENSION: 0.063" L x 0.031" W 1.60mm x 0.80mm; TEMPERATURECOEFFICIENT: 100ppm°C; TOLERANCE: 5%; VENDOR: Yageo; VOLTAGEWORKING: 50V
R20-R27 = 49.9-resistor:RC0402FR-0749K9L; MANUFACTURER_PART_NUMBER: RC0402FR0749K9L; VENDOR: Yageo
T1 T2 = thanics_robotics:ALT4532M
U1 = ICM-20948-mpu:ICM-20948
U2 = lan9512:LAN9512-JZX; MANUFACTURER_PART_NUMBER: LAN9512JZX; VENDOR: MICROCHIP
U3 = mpl115a1-barometer:MPL115A2
U4 = ubloxLib:NEO-M8: u-blox NEO GNSS module
U5 = thanics_robotics:AZ1117EH-1.8
U6 = raspberrypi_cm:COMPUTE_MODULE: Raspberry Pi Compute Module www.hasseb.fi
U7 = thanics_robotics:PDDL2450
U8 = thanics_robotics:74HC4053
U9 = thanics_robotics:FXMAR2102
U10 = thanics_robotics:STM32F446
U11 = esp8266modules:ESP12E: ESP12E Module